# EAGLE design Stick (EAGLE 7.2.0)

## Sheet 1 of 2
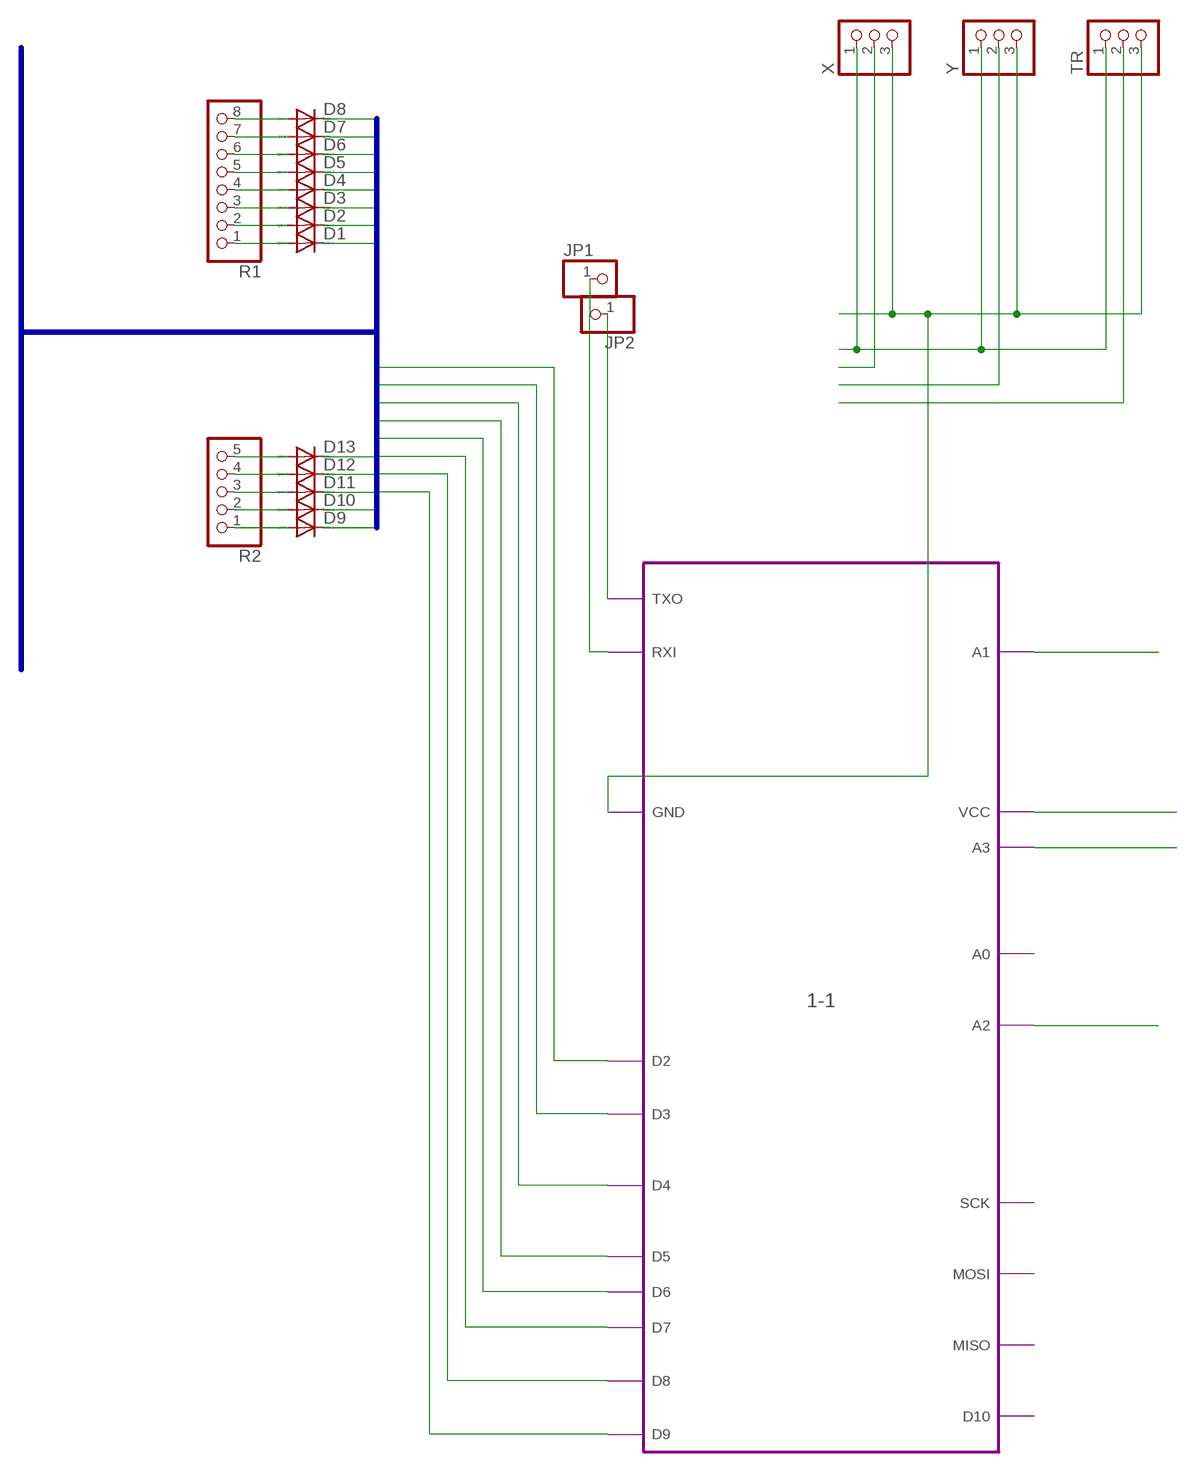
[diagram p0: schematic, sheet 1]

### Parts
D1  DIODE-MINIMELF  [MINIMELF]
D2  DIODE-MINIMELF  [MINIMELF]
D3  DIODE-MINIMELF  [MINIMELF]
D4  DIODE-MINIMELF  [MINIMELF]
D5  DIODE-MINIMELF  [MINIMELF]
D6  DIODE-MINIMELF  [MINIMELF]
D7  DIODE-MINIMELF  [MINIMELF]
D8  DIODE-MINIMELF  [MINIMELF]
D9  DIODE-MINIMELF  [MINIMELF]
D10  DIODE-MINIMELF  [MINIMELF]
D11  DIODE-MINIMELF  [MINIMELF]
D12  DIODE-MINIMELF  [MINIMELF]
D13  DIODE-MINIMELF  [MINIMELF]
JP1  PINHD-1X1  [1X01]
JP2  PINHD-1X1  [1X01]
R1  PINHD-1X8  [1X08]
R2  PINHD-1X5  [1X05]
TR  PINHD-1X3  [1X03]
X  PINHD-1X3  [1X03]
Y  PINHD-1X3  [1X03]

### Module instances
1-1 = 1

### Nets
D2: D8.C ; port 1-1.D2 ; also sheet 2
D9: D1.C D9.C ; port 1-1.D9 ; also sheet 2
GND: TR.3 X.3 Y.3 ; port 1-1.GND
N$2: JP2.1 ; port 1-1.TXO
N$3: D1.A R1.1
N$4: D2.A R1.2
N$5: D3.A R1.3
N$6: D4.A R1.4
N$7: D5.A R1.5
N$8: D6.A R1.6
N$9: D7.A R1.7
N$10: D8.A R1.8
N$11: D9.A R2.1
N$12: D10.A R2.2
N$13: D11.A R2.3
N$14: D12.A R2.4
N$15: D13.A R2.5
N$16: TR.1 X.1 Y.1 ; port 1-1.VCC
N$20: X.2 ; port 1-1.A3
N$21: Y.2 ; port 1-1.A2
N$22: TR.2 ; port 1-1.A1
R2: D2.C D10.C ; port 1-1.D8
R3: D3.C D11.C ; port 1-1.D7
R4: D4.C D12.C ; port 1-1.D6
R5: D5.C D13.C ; port 1-1.D5
R6: D6.C ; port 1-1.D4
R7: D7.C ; port 1-1.D3
RXI: JP1.1 ; port 1-1.RXI ; also sheet 2

### Buses
R[1..8]

## Sheet 2 of 2
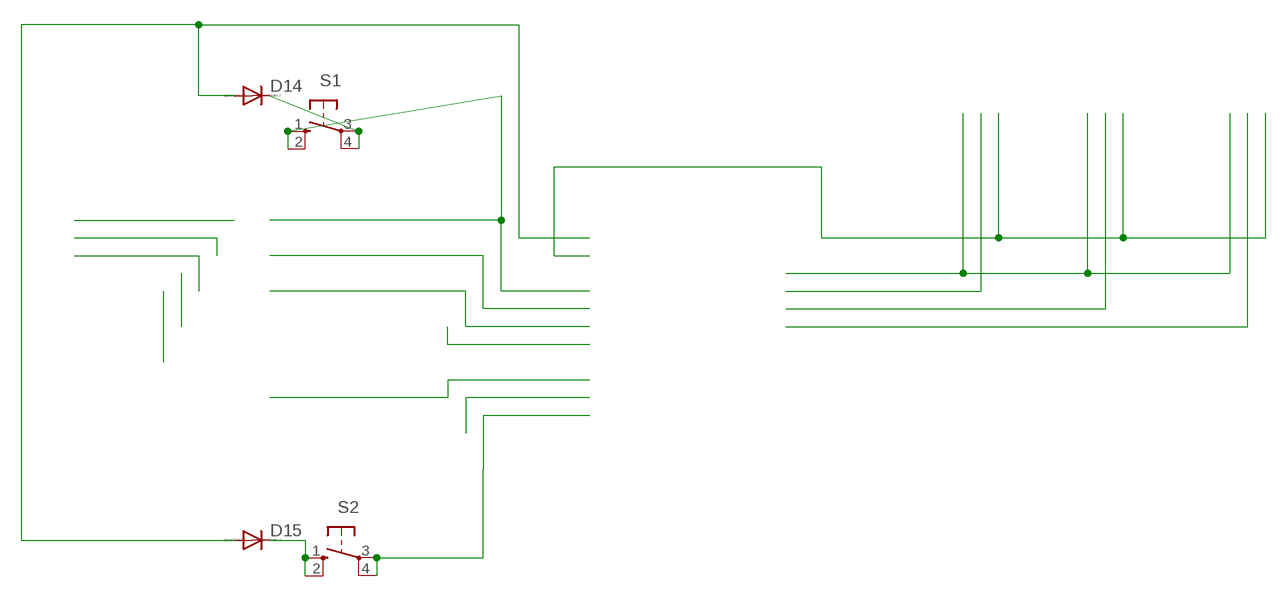
[diagram p1: schematic, sheet 2]

### Parts
D14  DIODE-DO-214AC  [DO-214AC]
D15  DIODE-DO-214AC  [DO-214AC]
S1  10-XX  [B3F-10XX]
S2  10-XX  [B3F-10XX]

### Nets
D2: S1.1(S) S1.2(S1) ; also sheet 1
D9: S2.3(P) S2.4(P1) ; also sheet 1
N$1: D15.C S2.1(S) S2.2(S1)
N$28: D14.C S1.3(P) S1.4(P1)
RXI: D14.A D15.A ; also sheet 1

## Library data of the parts
D1-D15 = diode:DIODE-: DIODE
JP1 JP2 = pinhead:PINHD-1X1: PIN HEADER
R1 = pinhead:PINHD-1X8: PIN HEADER
R2 = pinhead:PINHD-1X5: PIN HEADER
S1 S2 = switch-omron:10-XX: OMRON SWITCH; MPN: B3F-1000; OC_FARNELL: 176432; OC_NEWARK: 36M3542
TR X Y = pinhead:PINHD-1X3: PIN HEADER

## Module 1
Ports: A0(io) D9(io) D8(io) D7(io) D6(io) D5(io) D4(io) D3(io) D2(io) GND(io) A1(io) A2(io) VCC(io) TXO(io) RXI(io) D10(io) MISO(io) MOSI(io) SCK(io) A3(io)
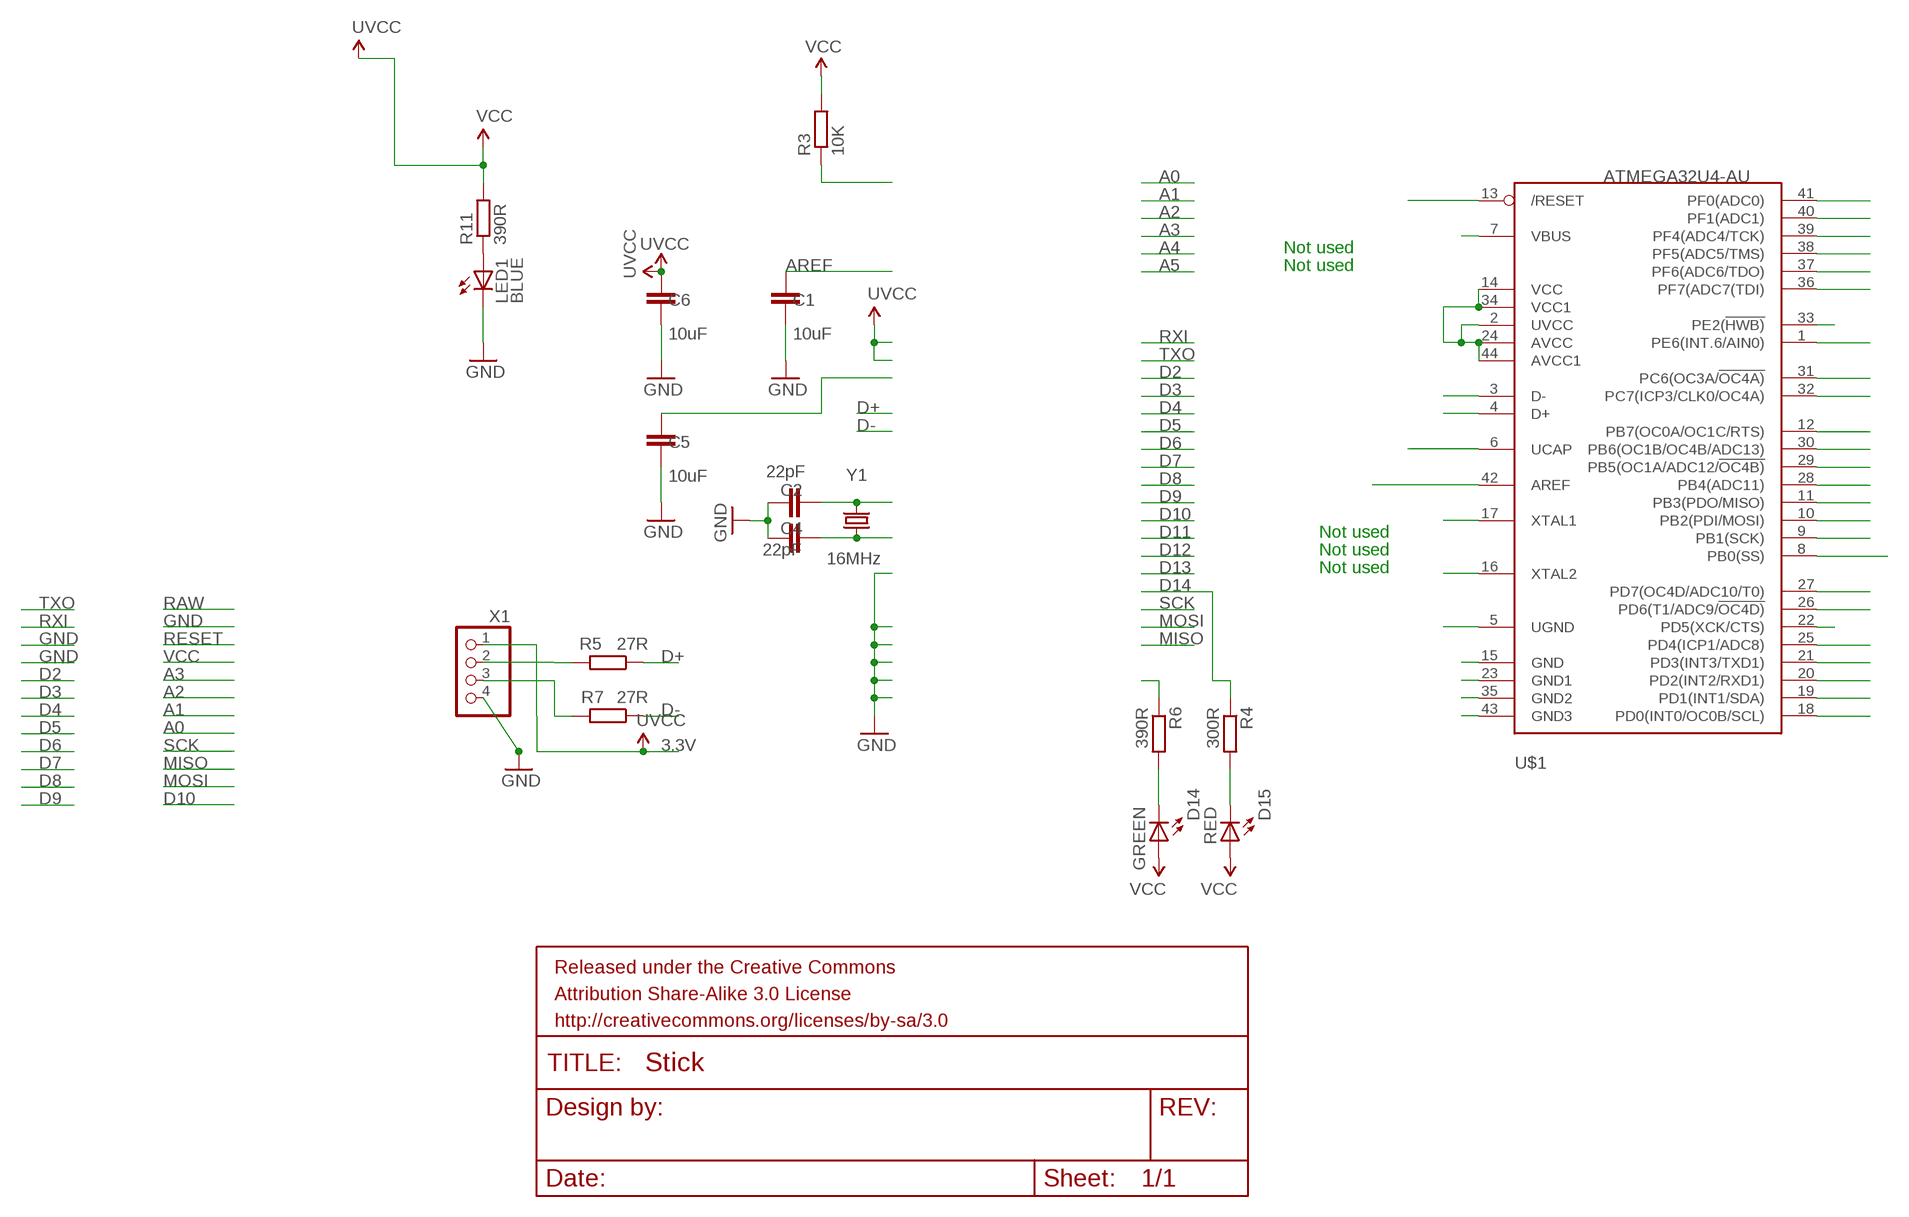
[diagram p2: schematic, module 1, sheet 1]

### Parts
C1  10uF  C-EUC1206  [C1206]
C2  22pF  C-EUC1206  [C1206]
C4  22pF  C-EUC1206  [C1206]
C5  10uF  C-EUC1206  [C1206]
C6  10uF  C-EUC1206  [C1206]
D14  GREEN  LED1206  [LED1206]
D15  RED  LED1206  [LED1206]
FRAME1  FRAME-LETTER  [CREATIVE_COMMONS]
LED1  BLUE  LED1206  [LED1206]
R3  10K  R-EU_R1206  [R1206]
R4  300R  R-EU_R1206  [R1206]
R5  27R  R-EU_R1206  [R1206]
R6  390R  R-EU_R1206  [R1206]
R7  27R  R-EU_R1206  [R1206]
R11  390R  R-EU_R1206  [R1206]
U$1  ATMEGA32U4-AU  [TQFP44]
X1  PINHD-1X4  [1X04]
Y1  16MHz  CRYSTALHC49S  [HC49/S]

### Nets
3.3V: C6.2 R11.2 U$1.2(UVCC) U$1.7(VBUS) U$1.14(VCC) U$1.24(AVCC) U$1.34(VCC1) U$1.44(AVCC1) X1.1 ; supply symbol labelled UVCC, VCC
A0: U$1.36(PF7(ADC7(TDI))
A1: U$1.37(PF6(ADC6/TDO))
A2: U$1.38(PF5(ADC5/TMS))
A3: U$1.39(PF4(ADC4/TCK))
A4: U$1.40(PF1(ADC1))
A5: U$1.41(PF0(ADC0))
AREF: C1.2 U$1.42(AREF)
D2: U$1.19(PD1(INT1/SDA))
D3: U$1.18(PD0(INT0/OC0B/SCL))
D4: U$1.25(PD4(ICP1/ADC8))
D5: U$1.31(PC6(OC3A/!OC4A))
D6: U$1.27(PD7(OC4D/ADC10/T0))
D7: U$1.1(PE6(INT.6/AIN0))
D8: U$1.28(PB4(ADC11))
D9: U$1.29(PB5(OC1A/ADC12/!OC4B))
D10: U$1.30(PB6(OC1B/OC4B/ADC13))
D11: U$1.12(PB7(OC0A/OC1C/RTS))
D12: U$1.26(PD6(T1/ADC9/!OC4D))
D13: U$1.32(PC7(ICP3/CLK0/OC4A))
D14: R4.1 U$1.8(PB0(SS))
D+: R5.1 U$1.4(D+)
D-: R7.1 U$1.3(D-)
GND [vcc]: C1.1 C2.2 C4.2 C5.1 C6.1 LED1.C U$1.5(UGND) U$1.15(GND) U$1.23(GND1) U$1.33(PE2(!HWB)) U$1.35(GND2) U$1.43(GND3) X1.4
MISO: U$1.11(PB3(PDO/MISO))
MOSI: U$1.10(PB2(PDI/MOSI))
N$23: C4.1 U$1.16(XTAL2) Y1.1
N$24: C2.1 U$1.17(XTAL1) Y1.2
N$25: C5.2 U$1.6(UCAP)
N$26: R7.2 X1.3
N$27: R5.2 X1.2
N$29: D15.C R4.2
N$30: D14.C R6.2
N$38: LED1.A R11.1
RESET: R3.1 U$1.13(/RESET)
RXI: U$1.20(PD2(INT2/RXD1))
SCK: U$1.9(PB1(SCK))
TXLED: R6.1 U$1.22(PD5(XCK/CTS))
TXO: U$1.21(PD3(INT3/TXD1))
VCC: D14.A D15.A R3.2

### Notes on the sheet
- Not used
- Not used
- Not used
- Not used
- Not used

### Library data of the parts
C1 C2 C4-C6 = rcl:C-EU: CAPACITOR, European symbol
D14 D15 LED1 = Namenlos:LED1206
FRAME1 = SparkFun-Aesthetics:FRAME-LETTER: Schematic Frame Standard 8.5x11 US Letter frame
R3-R7 R11 = rcl:R-EU_: RESISTOR, European symbol
U$1 = Namenlos at:ATMEGA32U4: http://www.ladyada.net/library/eagle
X1 = pinhead:PINHD-1X4: PIN HEADER
Y1 = Namenlos at:CRYSTAL: CRYSTAL; OC_FARNELL: 1667008; OC_NEWARK: unknown

## Board
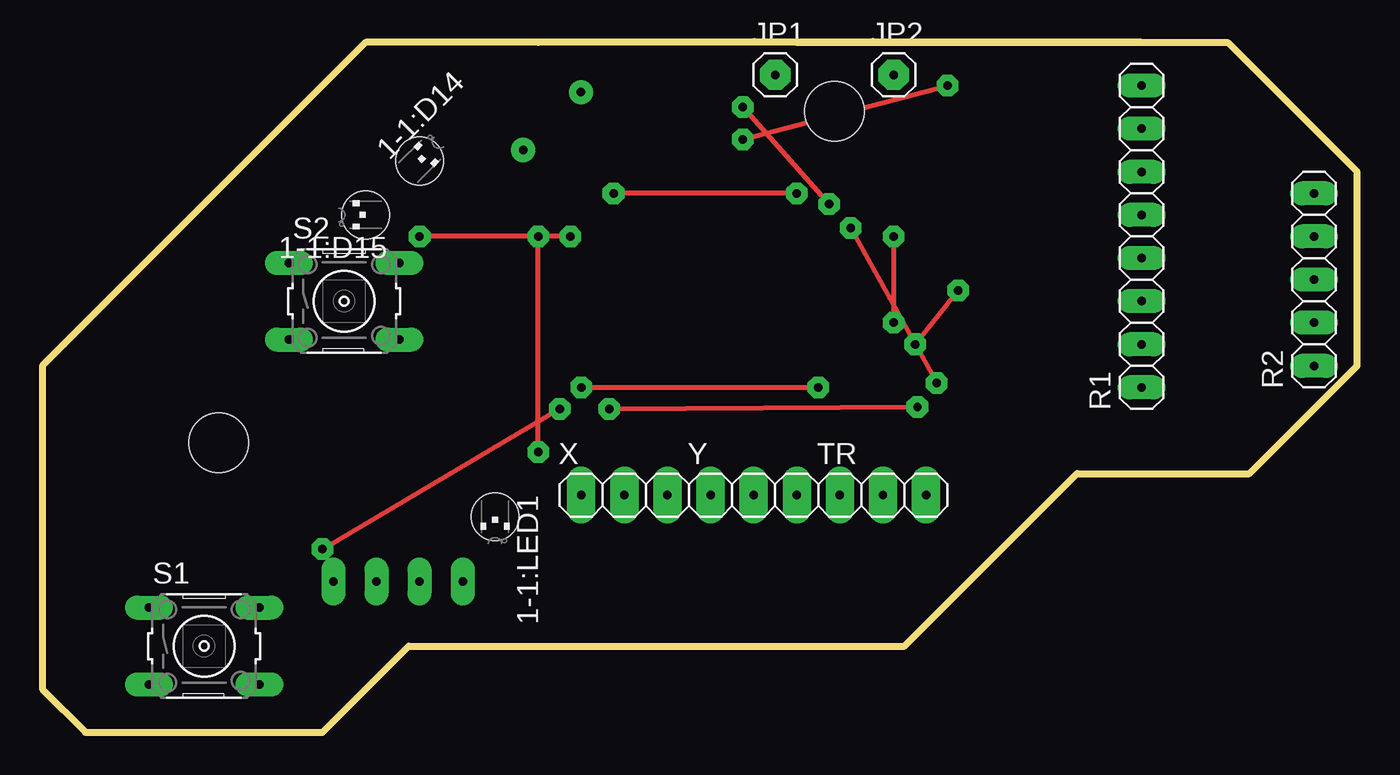
[diagram p3: board, top side]
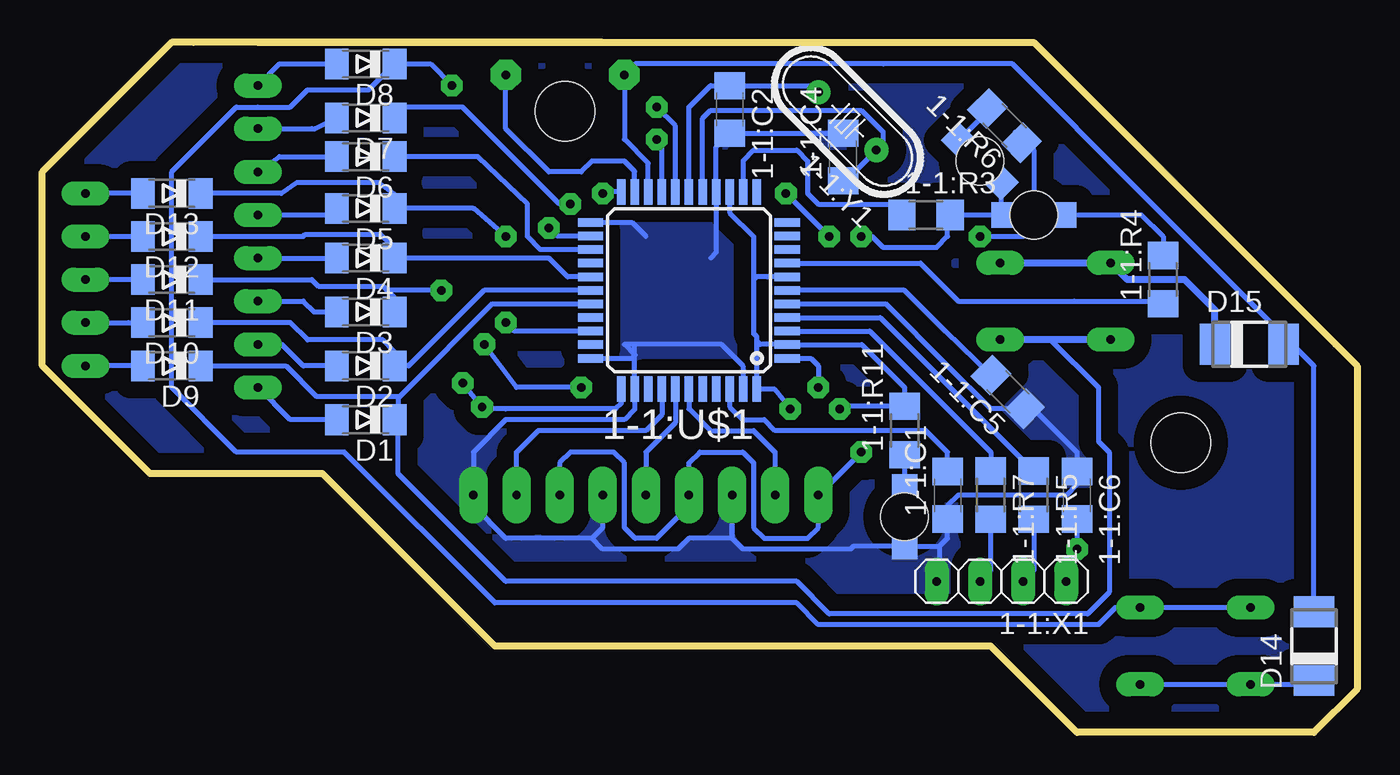
[diagram p4: board, bottom side, seen from below]

Size 77.47 x 40.64 mm. Coordinates in mm from the lower left corner, seen from the top.
Outline: 64.77,40.64 29.21,40.64 19.05,40.64 1.27,22.86 0,21.59 0,2.54 2.54,0 16.51,0 19.05,2.54 21.59,5.08 50.8,5.08 60.96,15.24 71.12,15.24 72.39,16.51 77.47,21.59 77.47,33.02 69.85,40.64 68.58,40.64 44.45,40.64
Copper layers (1*16): Top 0.035mm / dielectric 1.5mm / Bottom 0.035mm
Design rules "default *": minimum track width 12mil, minimum drill 24mil, track to track 12mil, track to pad 12mil, pad to pad 12mil, via to via 12mil, smd to smd 12mil, copper to edge 40mil, drill to drill 8mil, minimum pad ring 10mil, minimum via ring 8mil, stop-mask expansion 4mil, vias tented up to drill 0mil, thermal gap 10mil
Holes 3.5 mm at 10.38,17.07 46.68,36.59

### Footprints (pad centres in the part's own frame; a part is rotated, then mirrored left to right if it is on the bottom)
C1206 = smd 1.6 x 1.8: 1 -1.4,0; 2 1.4,0
LED1206 = smd 1.5 x 1.5 bottom: A 0,-1.75; C 0,1.75 | hole 2.8: 0,0
R1206 = smd 1.6 x 1.803: 1 -1.422,0; 2 1.422,0
TQFP44 = smd 1.5 x 0.5: 1 -5.8,4; 2 -5.8,3.2; 3 -5.8,2.4; 4 -5.8,1.6; 5 -5.8,0.8; 6 -5.8,0; 7 -5.8,-0.8; 8 -5.8,-1.6; 9 -5.8,-2.4; 10 -5.8,-3.2; 11 -5.8,-4; 23 5.8,-4; 24 5.8,-3.2; 25 5.8,-2.4; 26 5.8,-1.6; 27 5.8,-0.8; 28 5.8,0; 29 5.8,0.8; 30 5.8,1.6; 31 5.8,2.4; 32 5.8,3.2; 33 5.8,4 | smd 0.5 x 1.5: 12 -4,-5.8; 13 -3.2,-5.8; 14 -2.4,-5.8; 15 -1.6,-5.8; 16 -0.8,-5.8; 17 0,-5.8; 18 0.8,-5.8; 19 1.6,-5.8; 20 2.4,-5.8; 21 3.2,-5.8; 22 4,-5.8; 34 4,5.8; 35 3.2,5.8; 36 2.4,5.8; 37 1.6,5.8; 38 0.8,5.8; 39 0,5.8; 40 -0.8,5.8; 41 -1.6,5.8; 42 -2.4,5.8; 43 -3.2,5.8; 44 -4,5.8
1X04 = drill 0.5 pad 1.422 long: 1 -3.81,0; 2 -1.27,0; 3 1.27,0; 4 3.81,0
HC49/S = drill 0.5 pad 1.422: 1 -2.413,0; 2 2.413,0
MINIMELF = smd 1.4 x 1.8: A 1.7,0; C -1.7,0
DO-214AC = smd 1.8 x 2.4: A 2.025,0; C -2.025,0
1X01 = drill 0.5 pad 1.778 octagon: 1 0,0
1X08 = drill 0.5 pad 1.422 long: 1 -8.89,0; 2 -6.35,0; 3 -3.81,0; 4 -1.27,0; 5 1.27,0; 6 3.81,0; 7 6.35,0; 8 8.89,0
1X05 = drill 0.5 pad 1.422 long: 1 -5.08,0; 2 -2.54,0; 3 0,0; 4 2.54,0; 5 5.08,0
B3F-10XX = drill 0.5 pad 1.422 long: 1 -3.251,2.261; 2 3.251,2.261; 3 -3.251,-2.261; 4 3.251,-2.261
1X03 = drill 0.5 pad 1.676 long: 1 -2.54,0; 2 0,0; 3 2.54,0

### Placement (x,y rotation side)
1-1:C1  10uF  [C1206]  24.13,13.97 90 bottom
1-1:C2  22pF  [C1206]  36.96,36.7 270 bottom
1-1:C4  22pF  [C1206]  30.29,33.9 90 bottom
1-1:C5  10uF  [C1206]  20.58,20.06 135 bottom
1-1:C6  10uF  [C1206]  16.51,13.97 270 bottom
1-1:D14  GREEN  [LED1206]  22.23,33.66 315 top
1-1:D15  RED  [LED1206]  19.05,30.48 90 top
1-1:FRAME1  FRAME-LETTER  [CREATIVE_COMMONS]  27.94,44.45 0 top  (outside the outline)
1-1:LED1  BLUE  [LED1206]  26.67,12.7 180 top
1-1:R3  10K  [R1206]  25.4,30.48 0 bottom
1-1:R4  300R  [R1206]  11.43,26.67 90 bottom
1-1:R5  27R  [R1206]  19.05,13.97 270 bottom
1-1:R6  390R  [R1206]  20.77,35.75 135 bottom
1-1:R7  27R  [R1206]  21.59,13.97 270 bottom
1-1:R11  390R  [R1206]  26.67,17.78 90 bottom
1-1:U$1  ATMEGA32U4-AU  [TQFP44]  39.37,26.04 180 bottom
1-1:X1  [1X04]  20.95,8.89 180 bottom
1-1:Y1  16MHz  [HC49/S]  30.03,36.01 135 bottom
D1  58.42,18.41 180 bottom
D2  58.42,21.59 180 bottom
D3  58.42,24.77 180 bottom
D4  58.42,27.94 180 bottom
D5  58.42,30.86 180 bottom
D6  58.42,33.91 180 bottom
D7  58.42,36.2 180 bottom
D8  58.42,39.37 180 bottom
D9  69.85,21.59 180 bottom
D10  69.85,24.13 180 bottom
D11  69.85,26.67 180 bottom
D12  69.85,29.21 180 bottom
D13  69.85,31.75 180 bottom
D14  2.54,5.08 90 bottom
D15  6.35,22.86 0 bottom
JP1  43.18,38.73 0 top
JP2  50.17,38.73 0 top
R1  64.77,29.21 90 top
R2  74.93,26.67 90 top
S1  9.53,5.08 0 top
S2  17.78,25.4 0 top
TR  49.53,13.97 0 top
X  34.29,13.97 0 top
Y  41.91,13.97 0 top

### Tracks (layer width: path | path; a pad name or v marks a point on that pad's centre or on a via)
1-1:3.3V  (via drill 0.5 pad 1.27)
  Top 0.305: v33.4,19.05 v51.56,19.18 | v47.62,29.72 v52.7,20.57 | v16.51,10.8 v30.48,19.05
  Bottom 0.305: 1-1:U$1.7 34.76,26.84 35.4,26.84 35.56,26.67 | 35.56,26.04 35.56,25.4 | 35.56,25.4 35.56,23.5 35.37,23.3 35.37,23.05 | v30.48,19.05 30.33,19.2 1-1:R11.2 26.67,20.32 29.19,22.84 1-1:U$1.2 33.59,22.86 35.18,22.86 35.37,23.05 | 1-1:X1.1 v16.51,10.8 16.51,11.43 1-1:C6.2 | 35.37,23.05 1-1:U$1.44 34.33,20.23 v33.4,19.05 | 1-1:U$1.14 36.97,30.62 35.56,29.21 35.56,26.67 | 35.56,26.67 35.56,25.4 | 1-1:U$1.24 47.14,29.23 v47.62,29.72 | 1-1:U$1.34 43.37,19.37 43.69,19.05 50.17,19.05 51.56,19.05 v51.56,19.18 v52.7,20.57
1-1:AREF
  Bottom 0.305: 1-1:C1.2 24.13,16.51 25.4,17.78 34.29,17.78 34.93,18.41 36.2,18.41 36.97,19.19 1-1:U$1.42
1-1:D14
  Bottom 0.305: 1-1:U$1.8 25.73,27.64 23.5,25.4 16.66,25.4 11.58,25.4 1-1:R4.1
1-1:D+
  Bottom 0.305: 1-1:U$1.4 28.09,24.44 1-1:R5.1
1-1:D-
  Bottom 0.305: 1-1:U$1.3 28.72,23.64 21.59,16.51 1-1:R7.1
1-1:N$23
  Bottom 0.305: 1-1:U$1.16 38.57,36.17 38.1,36.64 29.21,36.64 27.94,35.37 27.94,34.69 1-1:Y1.1 30.13,32.49 1-1:C4.1
1-1:N$24
  Bottom 0.305: 31.82,37.63 1-1:Y1.2 32.12,38.1 1-1:C2.1 38.1,38.1 39.37,36.83 1-1:U$1.17
1-1:N$25
  Bottom 0.305: 1-1:C5.2 24.22,23.59 26.67,26.04 1-1:U$1.6
1-1:N$26
  Bottom 0.305: 1-1:X1.3 21.59,9.52 1-1:R7.2
1-1:N$27
  Bottom 0.305: 1-1:R5.2 19.05,9.52 1-1:X1.2
1-1:N$29
  Bottom 0.305: 1-1:D15.C 12.7,30.48 11.43,29.21 1-1:R4.2
1-1:N$30
  Bottom 0.305: 1-1:R6.2 22.24,36.75 22.24,36.12 1-1:D14.C
1-1:N$38
  Bottom 0.305: 1-1:R11.1 1-1:LED1.A
1-1:RESET
  Bottom 0.305: 1-1:U$1.13 36.17,33.68 35.56,34.29 33.02,34.29 32.38,33.66 32.38,31.75 31.75,31.12 27.46,31.12 1-1:R3.1
1-1:TXLED  (via drill 0.5 pad 1.27)
  Top 0.305: v44.45,31.75 v33.66,31.75 | v31.12,29.21 v22.23,29.21
  Bottom 0.305: 44.37,31.84 1-1:U$1.22 44.37,31.84 | 44.37,31.84 v44.45,31.75 44.37,31.84 | v33.66,31.75 v31.12,29.21 | v22.23,29.21 19.69,29.21 19.37,29.53 | 19.37,29.53 19.05,29.84 | 20.13,35.38 1-1:R6.1 19.5,34.74 19.05,34.29 19.05,29.84 | 19.05,29.84 19.37,29.53
D2  (via drill 0.5 pad 1.27)
  Top 0.305: v41.27,34.93 v53.34,38.1
  Bottom 0.305: S1.1 S1.2 14.25,7.34 15.24,6.35 31.75,6.35 33.02,7.62 50.8,7.62 59.69,16.51 66.04,16.51 69.85,20.32 69.85,33.02 66.04,36.83 64.77,36.83 62.87,36.83 61.85,37.85 58.24,37.85 D8.C 54.61,39.37 v53.34,38.1 | 1-1:U$1.19 40.97,34.62 v41.27,34.93
D9
  Bottom 0.305: 56.13,20.07 50.97,25.23 1-1:U$1.29 | 56.13,20.07 56.52,19.69 56.52,18.62 D1.C 56.52,18.21 56.52,15.24 50.17,8.89 33.02,8.89 31.12,6.99 15.88,6.99 14.61,8.25 14.61,16.51 15.24,17.14 15.24,20.32 18.06,23.14 S2.4 | 56.13,20.07 56.39,19.81 61.34,19.81 63.12,21.59 D9.C
  Bottom 0.406: S2.3 S2.4
GND
  Bottom 0.305: 42.55,22.86 37.47,22.86 36.17,21.57 1-1:U$1.43 | 42.55,22.86 43.18,22.86 42.55,22.23 42.73,22.04 1-1:U$1.33 | 42.55,22.86 42.57,22.84 1-1:U$1.35 42.57,19.03 43.18,18.41 50.17,18.41 52.07,16.51 TR.3 52.07,13.34 50.17,11.43 45.09,11.43 | 24.61,10.95 1-1:LED1.C 29.69,10.95 29.84,10.8 36.2,10.8 36.83,11.43 | 24.61,10.95 24.13,11.43 24.13,12.07 | 24.13,12.07 1-1:C1.1 | 36.83,11.43 X.3 36.83,11.43 | 1-1:U$1.5 27.77,25.23 24.13,21.59 | 24.11,21.61 24.13,21.59 | 24.13,21.59 21.59,19.05 21.57,19.07 1-1:C5.1 19.07,19.07 16.51,16.51 1-1:C6.1 | 1-1:C6.1 16.51,15.24 | 16.51,15.24 1-1:C6.1 | 24.61,10.95 24.61,8.1 1-1:X1.4 | Y.3 44.45,12.07 45.09,11.43 | 36.83,11.43 39.37,11.43 40.01,10.8 44.45,10.8 45.09,11.43 | 16.51,15.24 16.51,14.61 17.14,13.97 23.5,13.97 24.13,13.34 24.13,12.07 | 38.1,27.94 37.77,28.27 37.77,30.34 1-1:U$1.15 37.77,34.49 1-1:C2.2 30.61,35.3 1-1:C4.2 | 1-1:U$1.23 42.73,30.04 41.91,29.21
  pour Bottom (isolate 1.016, no thermals): 0,21.59 19.05,40.64 69.85,40.64 77.47,33.02 77.47,21.59 71.12,15.24 60.96,15.24 50.8,5.08 21.59,5.08 16.51,0 2.54,0 0,2.54
N$1
  Bottom 0.406: D15.C 8.38,24.89 10.16,26.67 13.54,26.67 S2.1 S2.2
N$2
  Bottom 0.305: 1-1:U$1.21 42.57,33.05 43.18,33.66 45.09,33.66 45.72,33.02 47.62,33.02 50.17,35.56 JP2.1
N$3
  Bottom 0.305: D1.A 62.87,18.41 R1.1
N$4
  Bottom 0.305: D2.A 62.1,21.59 63.37,22.86 R1.2
N$5
  Bottom 0.305: R1.3 62.1,25.4 61.47,24.77 D3.A
N$6
  Bottom 0.305: R1.4 D4.A
N$7
  Bottom 0.305: R1.5 60.76,30.48 D5.A
N$8
  Bottom 0.305: R1.6 63.5,33.91 D6.A
N$9
  Bottom 0.305: R1.7 61.59,35.56 61.39,35.56 D7.A
N$10
  Bottom 0.305: R1.8 63.5,39.37 D8.A
N$11
  Bottom 0.305: D9.A R2.1
N$12
  Bottom 0.305: R2.2 72.39,24.13 D10.A | D10.A 71.12,24.13 D10.A
N$13
  Bottom 0.305: D11.A R2.3
N$14
  Bottom 0.305: R2.4 D12.A
N$15
  Bottom 0.305: D13.A R2.5
N$16  (via drill 0.5 pad 1.27)
  Top 0.305: v29.21,16.51 v29.21,29.21
  Bottom 0.305: TR.1 46.99,15.88 46.36,16.51 43.81,16.51 43.18,15.88 43.18,12.07 42.55,11.43 41.27,11.43 39.37,13.34 Y.1 39.37,15.88 38.73,16.51 36.2,16.51 35.56,15.88 35.56,12.07 34.93,11.43 32.38,11.43 31.75,12.07 X.1 v29.21,16.51 | v29.21,29.21 28.58,29.21 27.94,28.57 24.77,28.57 24.13,29.21 24.13,30.33 1-1:R3.2 1-1:D15.A 20.99,30.67 1-1:D14.A
N$20
  Bottom 0.305: 1-1:U$1.39 39.37,19.05 38.1,17.78 35.56,17.78 34.29,16.51 X.2
N$21
  Bottom 0.305: 1-1:U$1.38 40.17,18.25 41.91,16.51 Y.2
N$22
  Bottom 0.305: TR.2 49.53,16.51 48.26,17.78 41.91,17.78 40.97,18.72 1-1:U$1.37
N$28
  Bottom 0.305: S1.4 S1.3 2.78,2.82 D14.C
R2
  Bottom 0.305: 1-1:U$1.28 51.44,26.04 55.88,21.59 D2.C 56.72,22.43 57.4,23.11 61.85,23.11 62.87,24.13 D10.C
R3  (via drill 0.5 pad 1.27)
  Top 0.305: v31.75,20.32 v45.72,20.32 | v51.44,22.86 v53.98,26.04
  Bottom 0.305: D3.C 56.72,25.61 57.15,26.04 | 57.15,26.04 57.4,26.29 61.21,26.29 61.59,26.67 D11.C | 1-1:U$1.1 32.2,22.04 31.75,21.59 v31.75,20.32 | v45.72,20.32 49.53,20.32 v51.44,22.86 | v53.98,26.04 57.15,26.04
R4
  Bottom 0.305: 1-1:U$1.27 46.52,26.84 47.62,27.94 D4.C 56.64,28.02 56.64,28.45 57.53,29.34 61.98,29.34 62.1,29.21 D12.C
R5  (via drill 0.5 pad 1.27)
  Top 0.305: v50.17,24.13 v50.17,29.21
  Bottom 0.305: 1-1:U$1.31 49.67,23.64 v50.17,24.13 | v50.17,29.21 52.07,30.86 D5.C 56.72,31.7 57.66,32.38 62.48,32.38 63.37,31.75 D13.C
R6
  Bottom 0.305: 1-1:U$1.25 48.12,28.44 48.9,29.21 48.9,31.12 51.82,33.91 D6.C
R7  (via drill 0.5 pad 1.27)
  Top 0.305: v41.27,36.83 v46.36,31.12
  Bottom 0.305: 1-1:U$1.18 40.17,35.73 v41.27,36.83 | 56.09,36.83 56.3,36.62 | 56.3,36.62 D7.C | 56.09,36.83 52.7,36.83 46.99,31.12 v46.36,31.12 | 56.09,36.83 56.3,36.62
RXI
  Bottom 0.305: D14.A 2.54,21.59 3.81,22.86 D15.A 4.33,23.38 12.7,31.75 20.32,39.37 27.94,39.37 42.55,39.37 JP1.1 43.18,34.93 41.77,33.52 1-1:U$1.20